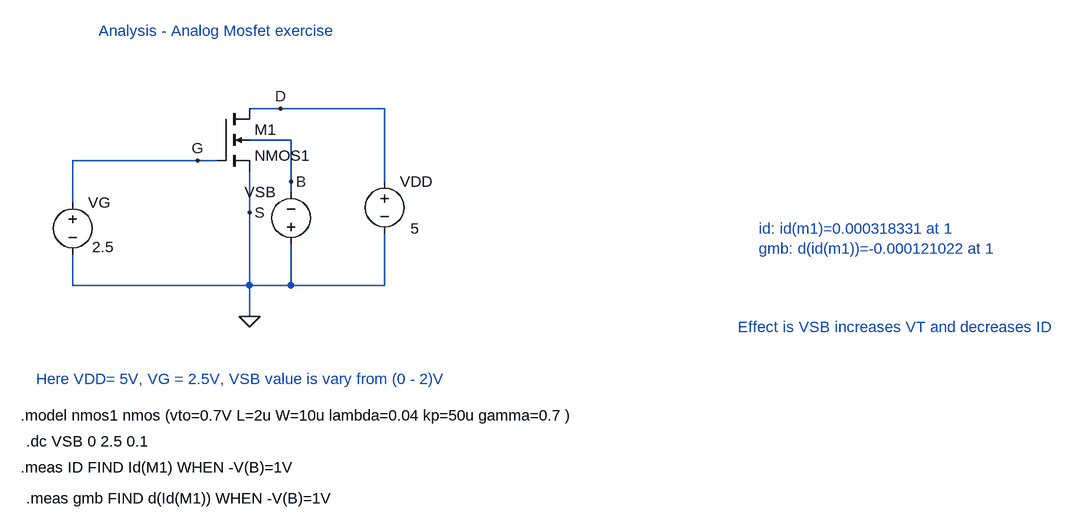
[diagram p0: schematic Variation in terms of body effect(gmb).asc]
Variation in terms of body effect(gmb).asc, the LTspice schematic file:
Version 4
SHEET 1 1552 728
WIRE 256 -48 208 -48
WIRE 416 -48 256 -48
WIRE 272 0 208 0
WIRE 128 32 -64 32
WIRE 160 32 128 32
WIRE 272 64 272 0
WIRE 416 64 416 -48
WIRE 272 80 272 64
WIRE -64 96 -64 32
WIRE 208 112 208 48
WIRE -64 224 -64 176
WIRE 208 224 208 112
WIRE 208 224 -64 224
WIRE 272 224 272 160
WIRE 272 224 208 224
WIRE 416 224 416 144
WIRE 416 224 272 224
WIRE 208 272 208 224
FLAG 208 272 0
FLAG 256 -48 D
FLAG 208 112 S
FLAG 128 32 G
FLAG 272 64 B
SYMBOL nmos4 160 -48 R0
SYMATTR InstName M1
SYMATTR Value NMOS1
SYMBOL voltage -64 80 R0
WINDOW 123 0 0 Left 0
WINDOW 39 0 0 Left 0
WINDOW 3 30 85 Left 2
SYMATTR Value 2.5
SYMATTR InstName VG
SYMBOL voltage 416 48 R0
WINDOW 123 0 0 Left 0
WINDOW 39 0 0 Left 0
WINDOW 3 40 88 Left 2
SYMATTR Value 5
SYMATTR InstName VDD
SYMBOL voltage 272 176 R180
WINDOW 0 24 96 Left 2
WINDOW 3 24 16 Left 2
WINDOW 123 0 0 Left 0
WINDOW 39 0 0 Left 0
SYMATTR InstName VSB
SYMATTR Value ""
TEXT -24 -168 Left 2 ;Analysis - Analog Mosfet exercise
TEXT -144 424 Left 2 !.model nmos1 nmos (vto=0.7V L=2u W=10u lambda=0.04 kp=50u gamma=0.7 )
TEXT -136 464 Left 2 !.dc VSB 0 2.5 0.1
TEXT -144 504 Left 2 !.meas ID FIND Id(M1) WHEN -V(B)=1V
TEXT -136 552 Left 2 !.meas gmb FIND d(Id(M1)) WHEN -V(B)=1V
TEXT -120 368 Left 2 ;Here VDD= 5V, VG = 2.5V, VSB value is vary from (0 - 2)V
TEXT 992 136 Left 2 ;id: id(m1)=0.000318331 at 1\ngmb: d(id(m1))=-0.000121022 at 1
TEXT 960 288 Left 2 ;Effect is VSB increases VT and decreases ID

The netlist it stands for:
* Variation in terms of body effect(gmb).asc
M1 D G 0 B NMOS1
VG G 0 2.5
VDD D 0 5
VSB 0 B
.model NMOS NMOS
.model PMOS PMOS
.lib standard.mos
* Analysis - Analog Mosfet exercise
.model nmos1 nmos (vto=0.7V L=2u W=10u lambda=0.04 kp=50u gamma=0.7 )
.dc VSB 0 2.5 0.1
.meas ID FIND Id(M1) WHEN -V(B)=1V
.meas gmb FIND d(Id(M1)) WHEN -V(B)=1V
* Here VDD= 5V, VG = 2.5V, VSB value is vary from (0 - 2)V
* id: id(m1)=0.000318331 at 1
* gmb: d(id(m1))=-0.000121022 at 1
* Effect is VSB increases VT and decreases ID
.backanno
.end

* Results of the author's LTspice run, read from the files saved beside the schematic
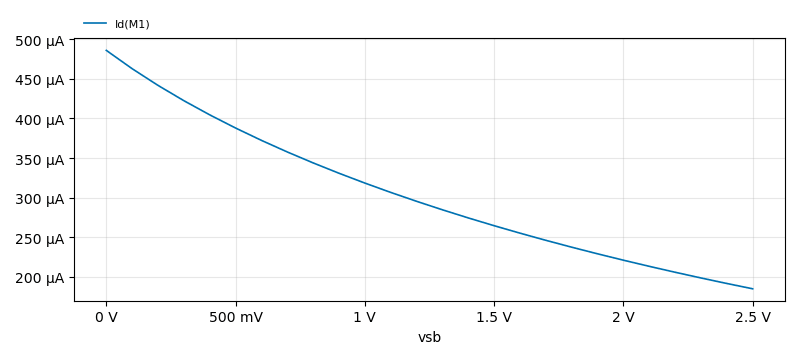
[diagram p1: DC transfer characteristic of Variation in terms of body effect(gmb).asc, plotted from the saved traces]
* DC transfer characteristic, 1 run:
*   Id(M1): 486 µA at vsb=0 V, 184.7 µA at vsb=2.5 V, min 184.7 µA, max 486 µA
* From the log:
*   id: id(m1)=0.000318331 at 1
*   gmb: d(id(m1))=-0.000121022 at 1